# EAGLE design ESB32CARRIER (EAGLE 9.6.0)
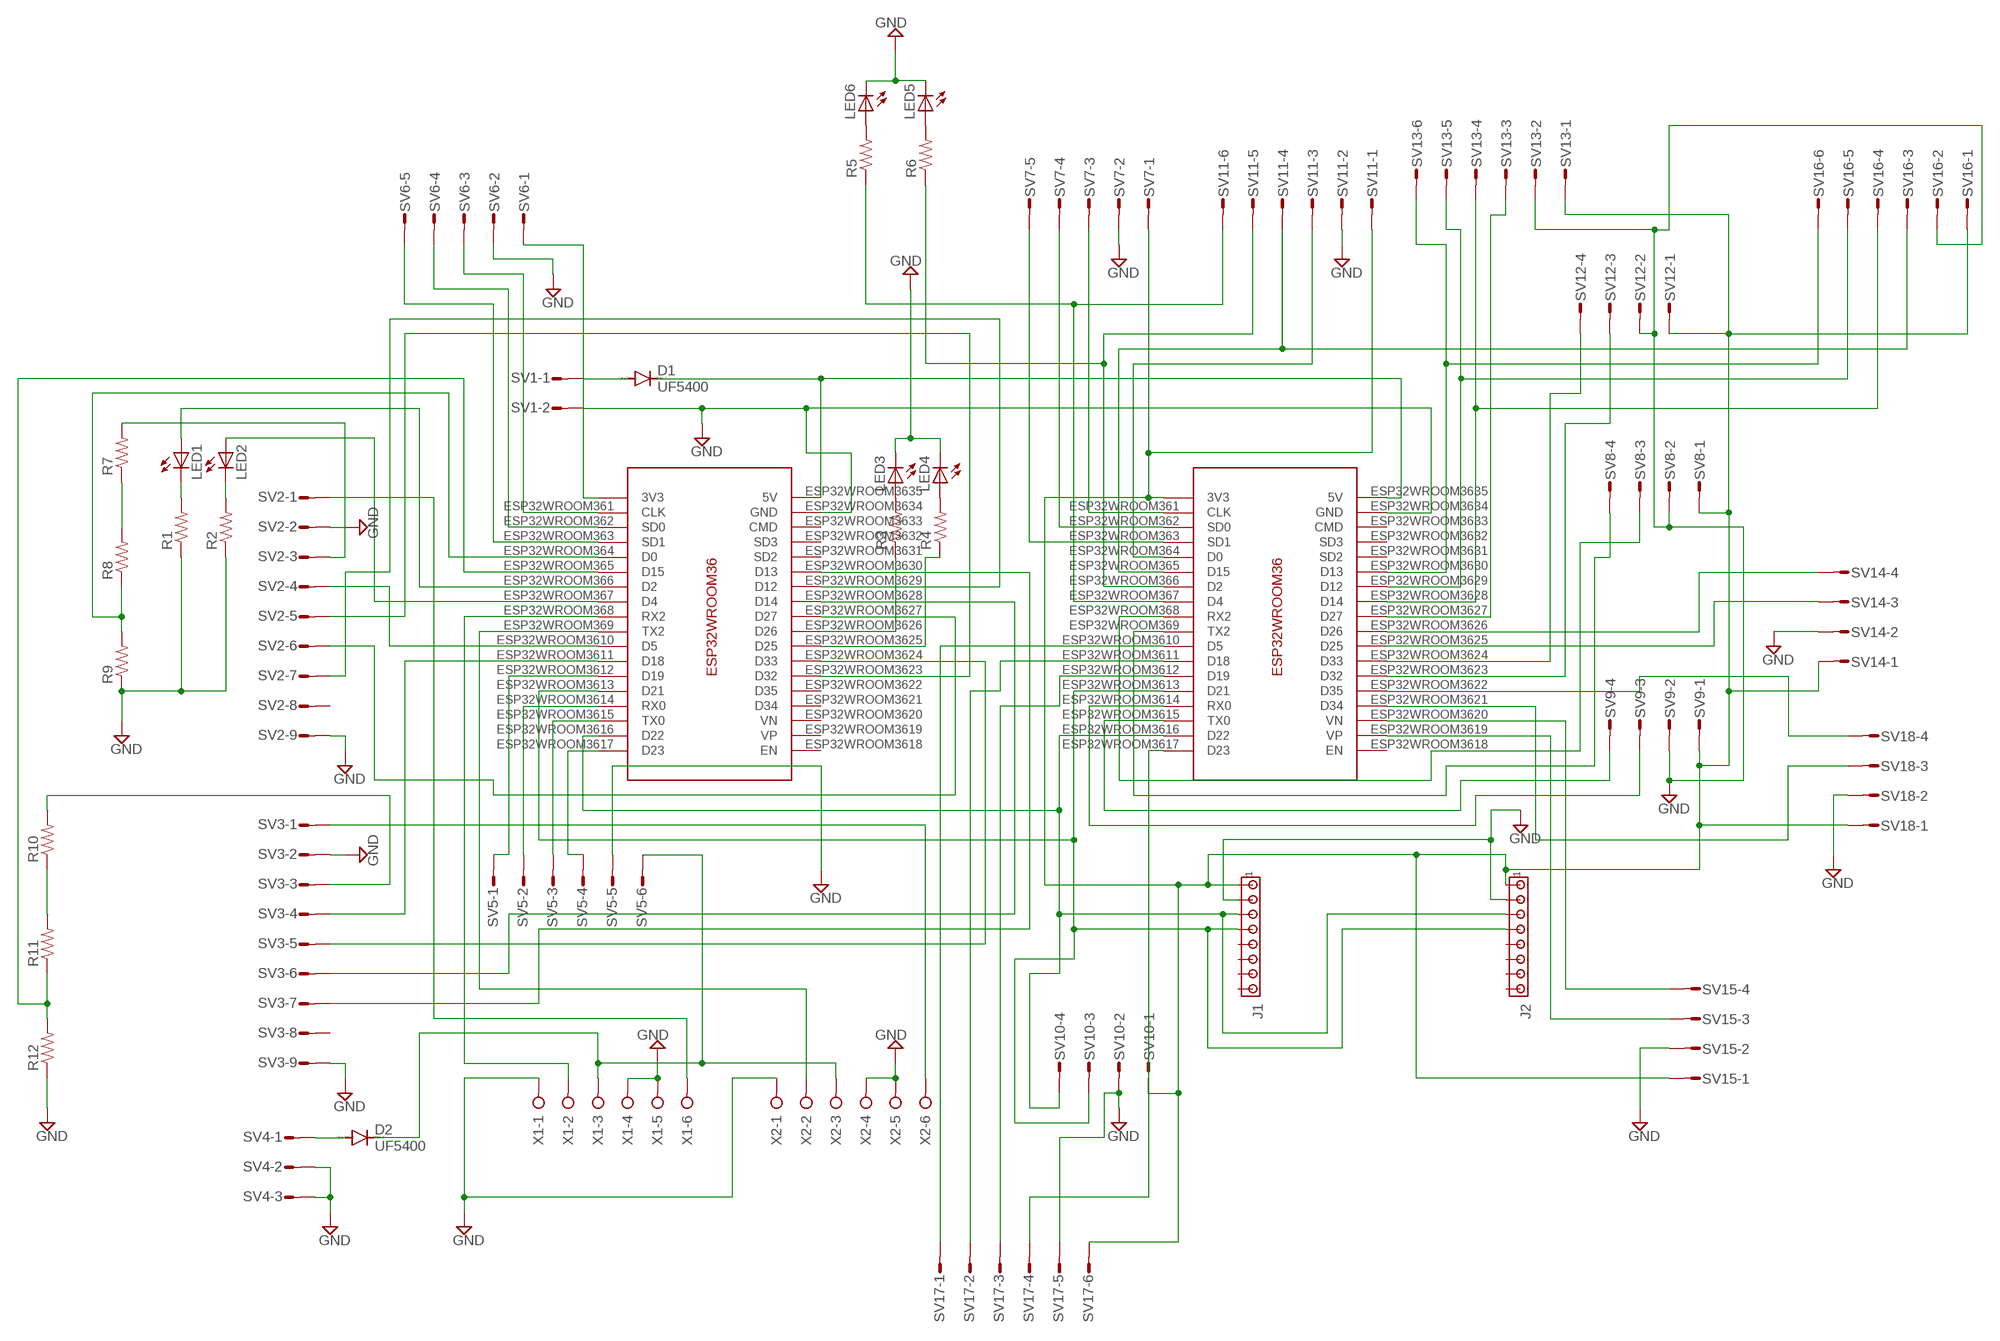
[diagram p0: schematic, sheet 1]

## Parts
D1  UF5400  [DO201-15]
D2  UF5400  [DO201-15]
J1  MTA08-100  [10X08MTA]
J2  MTA08-100  [10X08MTA]
LED1  LED3MM  [LED3MM]
LED2  LED3MM  [LED3MM]
LED3  LED3MM  [LED3MM]
LED4  LED3MM  [LED3MM]
LED5  LED3MM  [LED3MM]
LED6  LED3MM  [LED3MM]
R1  R-US_0207/10  [0207/10]
R2  R-US_0207/10  [0207/10]
R3  R-US_0207/10  [0207/10]
R4  R-US_0207/10  [0207/10]
R5  R-US_0207/10  [0207/10]
R6  R-US_0207/10  [0207/10]
R7  R-US_0207/10  [0207/10]
R8  R-US_0207/10  [0207/10]
R9  R-US_0207/10  [0207/10]
R10  R-US_0207/10  [0207/10]
R11  R-US_0207/10  [0207/10]
R12  R-US_0207/10  [0207/10]
SV1  L02P  [L02P]
SV2  L09P  [L09P]
SV3  L09P  [L09P]
SV4  L03P  [L03P]
SV5  L06P  [L06P]
SV6  L05P  [L05P]
SV7  L05P  [L05P]
SV8  L04P  [L04P]
SV9  L04P  [L04P]
SV10  L04P  [L04P]
SV11  L06P  [L06P]
SV12  L04P  [L04P]
SV13  L06P  [L06P]
SV14  L04P  [L04P]
SV15  L04P  [L04P]
SV16  L06P  [L06P]
SV17  L06P  [L06P]
SV18  L04P  [L04P]
U$1  ESP32WROOM36  [ESP32WROOM36PINDIP]
U$2  ESP32WROOM36  [ESP32WROOM36PINDIP]
X1  W237-06P  [W237-6P]
X2  W237-06P  [W237-6P]

## Nets
GND: J1.2 J2.2 LED3.K(C) LED4.K(C) LED5.K(C) LED6.K(C) R1.1 R2.1 R9.1 R12.1 SV1.2 SV2.2 SV2.9 SV3.2 SV3.9 SV4.2 SV4.3 SV5.5 SV6.2 SV7.2 SV8.2 SV9.2 SV10.2 SV11.2 SV12.2 SV13.2 SV14.2 SV15.2 SV16.2 SV17.5 SV18.2 U$1.ESP32WROOM3634(GND) U$2.ESP32WROOM3634(GND) X1.1 X1.4 X1.5 X2.1 X2.4 X2.5
N$1: D1.C U$1.ESP32WROOM3635(5V) U$2.ESP32WROOM3635(5V)
N$2: SV2.1 X1.6
N$3: D2.A SV4.1
N$4: SV3.1 X2.6
N$5: R7.1 R8.2
N$6: SV2.6 U$1.ESP32WROOM3627(D27)
N$7: D1.A SV1.1
N$8: SV5.1 U$1.ESP32WROOM3612(D19)
N$9: SV2.4 U$1.ESP32WROOM3610(D5)
N$10: U$1.ESP32WROOM368(RX2) X1.2
N$11: U$1.ESP32WROOM369(TX2) X2.2
N$12: R7.2 SV2.3
N$13: R11.1 R12.2 U$1.ESP32WROOM365(D15)
N$14: R10.1 R11.2
N$15: R10.2 SV3.3
N$16: R8.1 R9.2 U$1.ESP32WROOM364(D0)
N$17: SV3.4 U$1.ESP32WROOM3611(D18)
N$18: SV2.5 U$1.ESP32WROOM3623(D32)
N$19: SV3.5 U$1.ESP32WROOM3624(D33)
N$20: SV3.6 U$1.ESP32WROOM3628(D14)
N$21: SV2.7 U$1.ESP32WROOM3629(D12)
N$22: SV3.7 U$1.ESP32WROOM3630(D13)
N$23: J1.1 J2.1 SV7.1 SV8.1 SV9.1 SV10.1 SV11.1 SV12.1 SV13.1 SV14.1 SV15.1 SV16.1 SV17.6 SV18.1 U$2.ESP32WROOM360(3V3)
N$24: SV6.1 U$1.ESP32WROOM360(3V3)
N$25: SV7.5 U$2.ESP32WROOM363(SD1)
N$26: J1.3 J2.3 SV10.4 U$1.ESP32WROOM3616(D22) U$2.ESP32WROOM3616(D22)
N$27: J1.4 J2.4 SV10.3 U$1.ESP32WROOM3613(D21) U$2.ESP32WROOM3613(D21)
N$28: SV17.1 U$2.ESP32WROOM3610(D5)
N$29: SV6.5 U$1.ESP32WROOM363(SD1)
N$30: SV6.4 U$1.ESP32WROOM362(SD0)
N$31: SV6.3 U$1.ESP32WROOM361(CLK)
N$32: SV7.4 U$2.ESP32WROOM362(SD0)
N$33: SV7.3 U$2.ESP32WROOM361(CLK)
N$34: SV9.3 U$2.ESP32WROOM3614(RX0)
N$35: SV9.4 U$2.ESP32WROOM3615(TX0)
N$36: SV13.6 SV16.6 U$2.ESP32WROOM3630(D13)
N$37: SV13.5 SV16.5 U$2.ESP32WROOM3629(D12)
N$38: SV8.4 U$2.ESP32WROOM369(TX2)
N$39: SV8.3 U$2.ESP32WROOM368(RX2)
N$40: SV11.3 U$2.ESP32WROOM364(D0)
N$41: SV11.4 SV16.3 U$2.ESP32WROOM365(D15)
N$42: R6.1 SV11.5 U$2.ESP32WROOM366(D2)
N$43: R5.1 SV11.6 U$2.ESP32WROOM367(D4)
N$44: SV12.3 U$2.ESP32WROOM3623(D32)
N$45: SV12.4 U$2.ESP32WROOM3624(D33)
N$46: SV13.4 SV16.4 U$2.ESP32WROOM3628(D14)
N$47: SV13.3 U$2.ESP32WROOM3627(D27)
N$48: SV17.2 U$2.ESP32WROOM3611(D18)
N$49: SV14.4 U$2.ESP32WROOM3626(D26)
N$50: SV14.3 U$2.ESP32WROOM3625(D25)
N$51: SV15.4 U$2.ESP32WROOM3620(VN)
N$52: SV15.3 U$2.ESP32WROOM3619(VP)
N$53: SV17.3 U$2.ESP32WROOM3612(D19)
N$54: SV17.4 U$2.ESP32WROOM3617(D23)
N$55: SV5.4 U$1.ESP32WROOM3617(D23)
N$56: SV5.2 U$1.ESP32WROOM3614(RX0)
N$57: D2.C SV5.6 X1.3 X2.3
N$58: LED3.A R3.2
N$59: SV5.3 U$1.ESP32WROOM3615(TX0)
N$60: LED1.K(C) R1.2
N$61: LED2.K(C) R2.2
N$62: LED1.A U$1.ESP32WROOM366(D2)
N$63: LED2.A U$1.ESP32WROOM367(D4)
N$64: LED4.A R4.2
N$65: R3.1 U$1.ESP32WROOM3626(D26)
N$66: R4.1 U$1.ESP32WROOM3625(D25)
N$67: LED6.A R5.2
N$68: SV18.4 U$2.ESP32WROOM3622(D35)
N$69: SV18.3 U$2.ESP32WROOM3621(D34)
N$70: LED5.A R6.2
Unconnected: J1.5 J1.6 J1.7 J1.8 J2.5 J2.6 J2.7 J2.8 SV2.8 SV3.8 U$1.ESP32WROOM3618(EN) U$1.ESP32WROOM3619(VP) U$1.ESP32WROOM3620(VN) U$1.ESP32WROOM3621(D34) U$1.ESP32WROOM3622(D35) U$1.ESP32WROOM3631(SD2) U$1.ESP32WROOM3632(SD3) U$1.ESP32WROOM3633(CMD) U$2.ESP32WROOM3618(EN) U$2.ESP32WROOM3631(SD2) U$2.ESP32WROOM3632(SD3) U$2.ESP32WROOM3633(CMD)

## Library data of the parts
D1 D2 = diode:UF5400: DIODE ultra fast rectifier, 3 A
J1 J2 = con-amp:MTA08-100: AMP connector
LED1-LED6 = adafruit:LED: LED OSRAM: - CHIPLED LG R971, LG N971, LY N971, LG Q971, LY Q971, LO R971, LY R971 LH N974, LH R974 LS Q976, LO Q976, LY Q976 LO Q996 - Hyper CHIPLED LW Q18S LB Q993, LB Q99A, LB R99A - SideLED LS A670, LO A670, LY A670, LG A670, LP A670 LB A673, LV A673, LT A673, LW A673 LH A674 LY A675 LS A676, LA A676, LO A676, LY A676, LW A676 LS A679, LY A679, LG A679 - Hyper Micro SIDELED® LS Y876, LA Y876, LO Y876, LY Y876 LT Y87S - SmartLED LW L88C, LW L88S LB L89C, LB L89S, LG L890 LS L89K, LO L89K, LY L89K LS L896, LA L896, LO L896, LY L896 - TOPLED LS T670, LO T670, LY T670, LG T670, LP T670 LSG T670, LSP T670, LSY T670, LOP T670, LYG T670 LG T671, LOG T671, LSG T671 LB T673, LV T673, LT T673, LW T673 LH T674 LS T676, LA T676, LO T676, LY T676, LB T676, LH T676, LSB T676, LW T676 LB T67C, LV T67C, LT T67C, LS T67K, LO T67K, LY T67K, LW E67C LS E67B, LA E67B, LO E67B, LY E67B, LB E67C, LV E67C, LT E67C LW T67C LS T679, LY T679, LG T679 LS T770, LO T770, LY T770, LG T770, LP T770 LB T773, LV T773, LT T773, LW T773 LH T774 LS E675, LA E675, LY E675, LS T675 LS T776, LA T776, LO T776, LY T776, LB T776 LHGB T686 LT T68C, LB T68C - Hyper Mini TOPLED® LB M676 - Mini TOPLED Santana® LG M470 LS M47K, LO M47K, LY M47K Source: http://www.osram.convergy.de/
R1-R12 = adafruit:R-US_: RESISTOR, American symbol
SV1 = con-amp-mt:L02P: AMP MT CONNECTOR; OC_FARNELL: unknown; OC_NEWARK: unknown
SV2 SV3 = con-amp-mt:L09P: AMP MT CONNECTOR; OC_FARNELL: unknown; OC_NEWARK: unknown
SV4 = con-amp-mt:L03P: AMP MT CONNECTOR; OC_FARNELL: unknown; OC_NEWARK: unknown
SV5 SV11 SV13 SV16 SV17 = con-amp-mt:L06P: AMP MT CONNECTOR; OC_FARNELL: unknown; OC_NEWARK: unknown
SV6 SV7 = con-amp-mt:L05P: AMP MT CONNECTOR; OC_FARNELL: unknown; OC_NEWARK: unknown
SV8-SV10 SV12 SV14 SV15 SV18 = con-amp-mt:L04P: AMP MT CONNECTOR; OC_FARNELL: unknown; OC_NEWARK: unknown
U$1 U$2 = ESP32WROOM36:ESP32WROOM36
X1 X2 = con-wago-508:W237-06P: WAGO SREW CLAMP; OC_FARNELL: unknown; OC_NEWARK: unknown

## Board
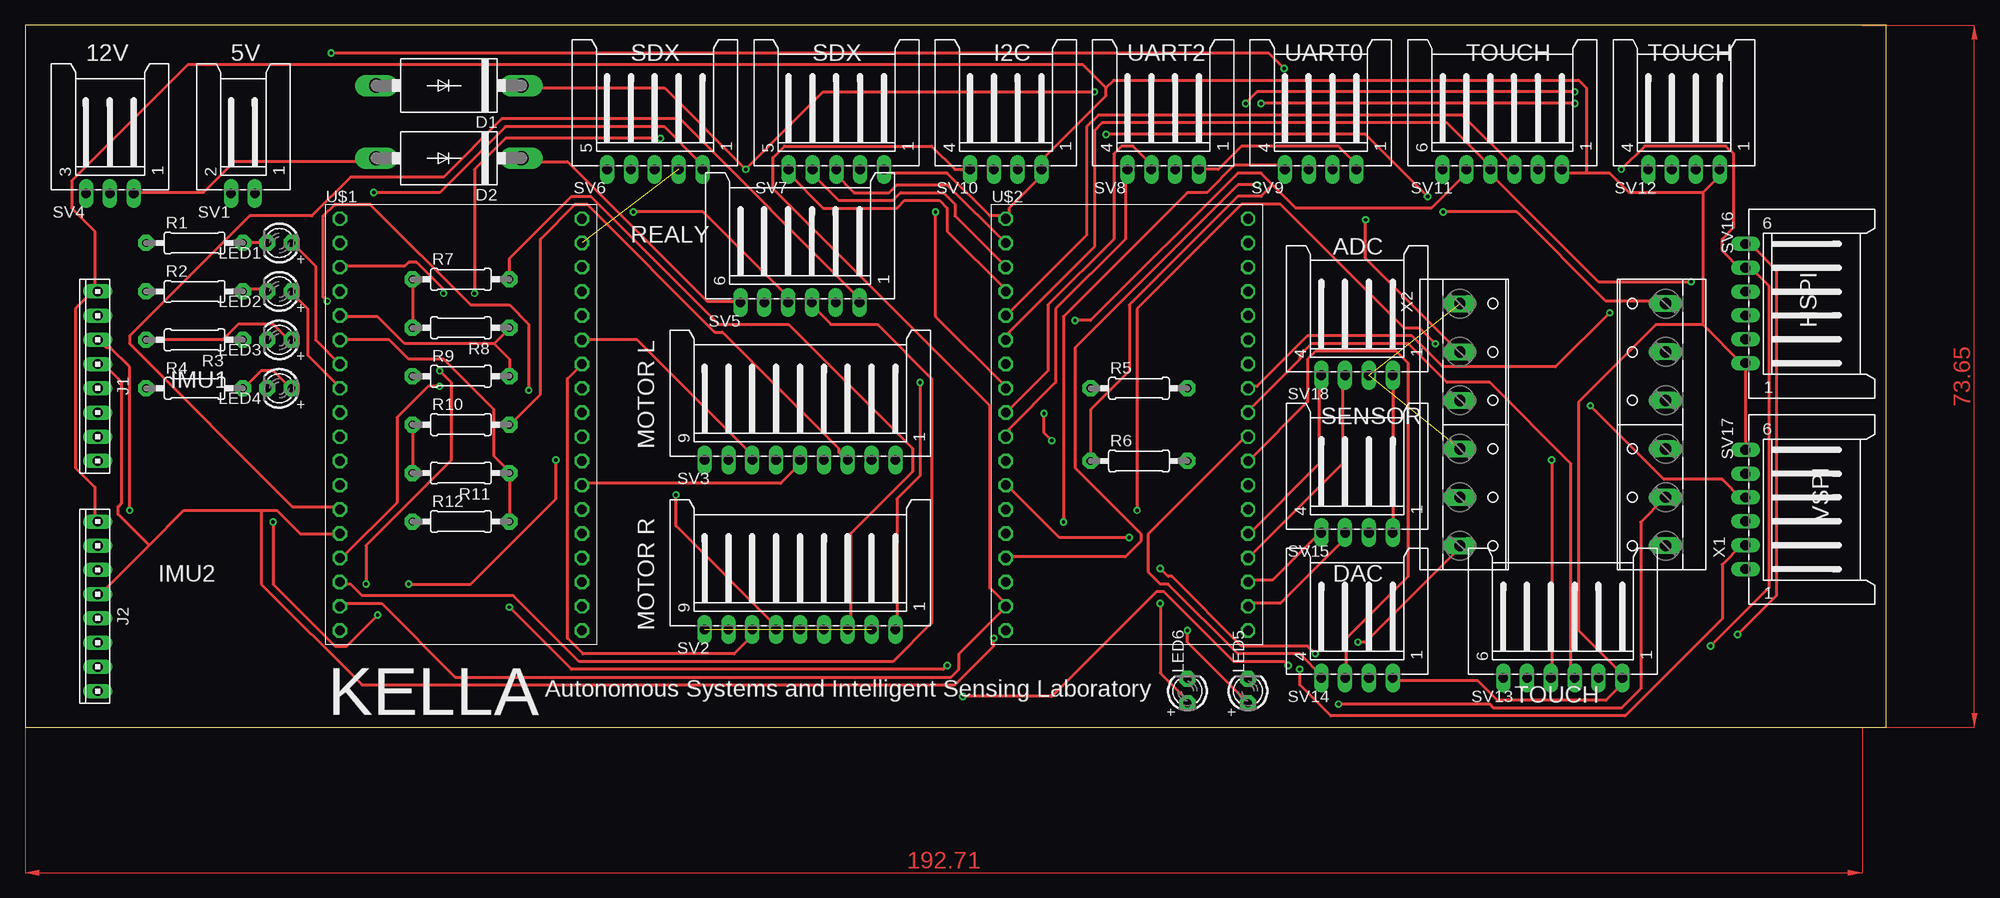
[diagram p1: board, top side]
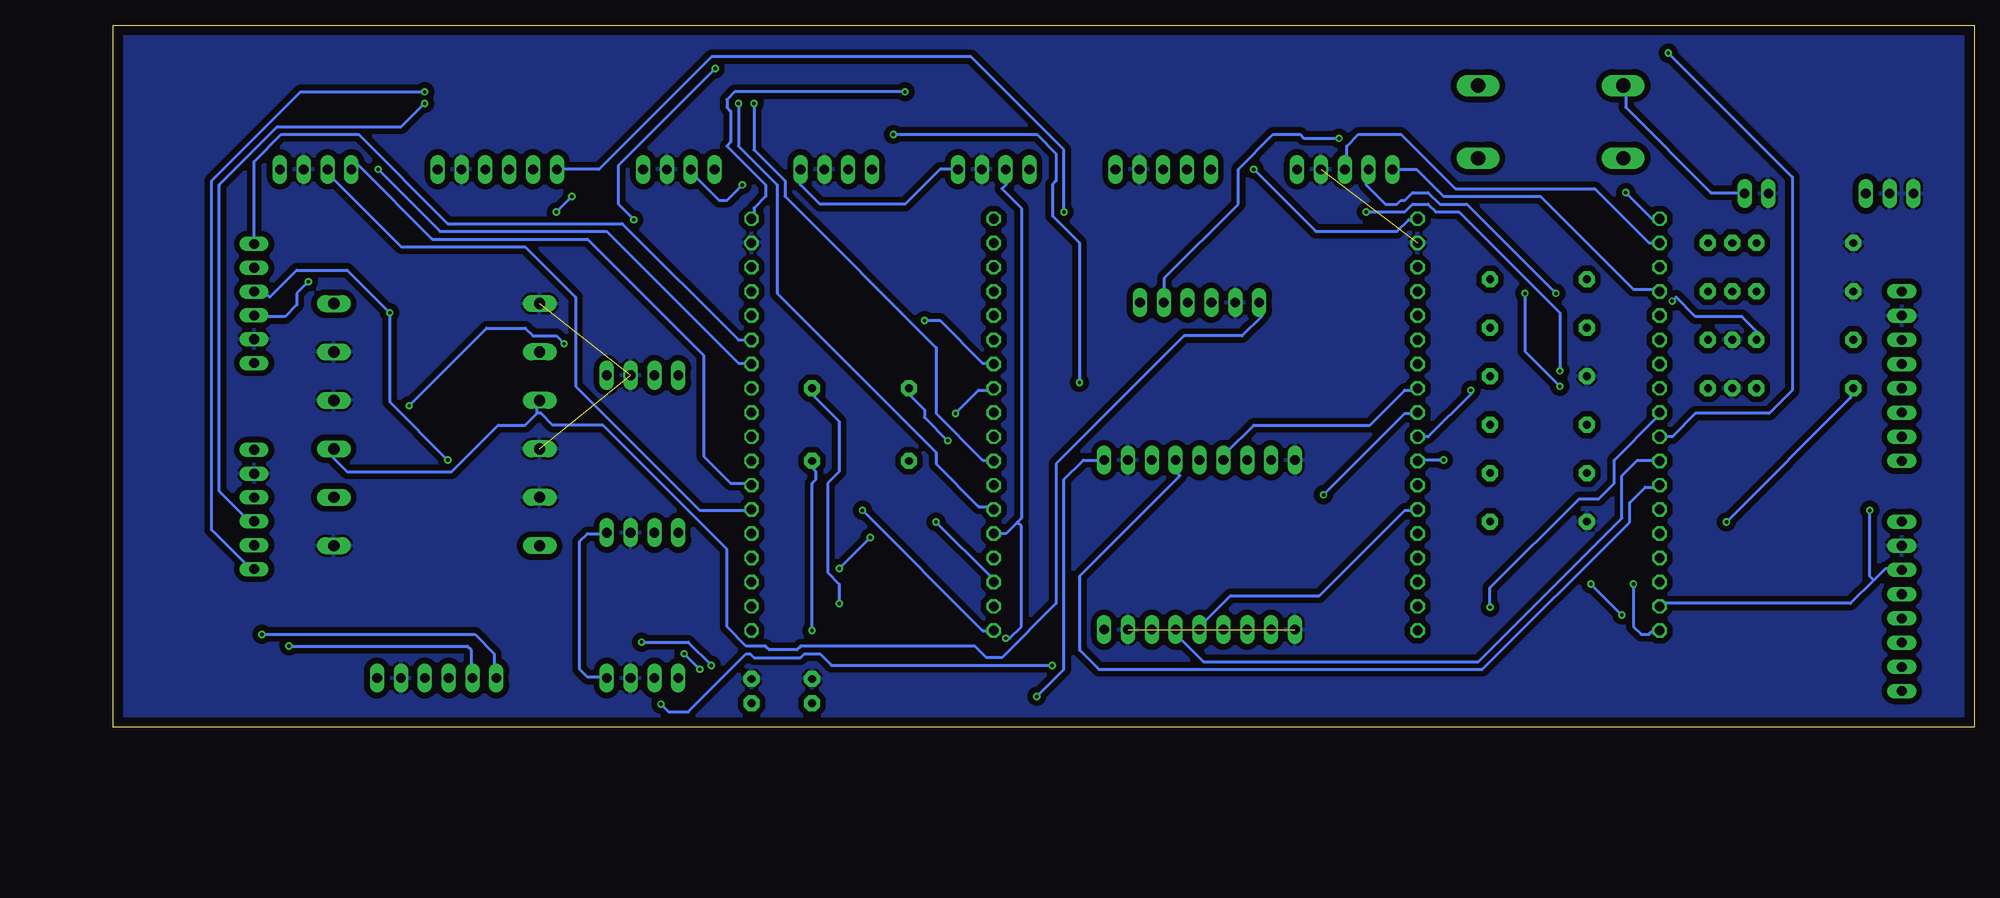
[diagram p2: board, bottom side, seen from below]

Size 195.25 x 73.65 mm. Coordinates in mm from the lower left corner, seen from the top.
Outline: 0,0 195.25,0 195.25,73.65 0,73.65 0,0
Copper layers (1*16): Top 0.035mm / dielectric 1.5mm / Bottom 0.035mm
Design rules "default *": minimum track width 12mil, minimum drill 0.35mm, track to track 20mil, track to pad 20mil, pad to pad 12mil, via to via 12mil, smd to smd 6mil, copper to edge 40mil, drill to drill 12mil, minimum pad ring 10mil, minimum via ring 8mil, stop-mask expansion 4mil, vias tented up to drill 0mil, thermal gap 10mil

### Footprints (pad centres in the part's own frame; a part is rotated, then mirrored left to right if it is on the bottom)
DO201-15 = drill 1.499 long: A 7.62,0; C -7.62,0
10X08MTA = drill 1.016 long: 1 8.89,0; 2 6.35,0; 3 3.81,0; 4 1.27,0; 5 -1.27,0; 6 -3.81,0; 7 -6.35,0; 8 -8.89,0
LED3MM = drill 0.813 pad 1.676 octagon: A -1.27,0; K 1.27,0
0207/10 = drill 0.813 pad 1.676 octagon: 1 -5.08,0; 2 5.08,0
L02P = drill 1.016 long: 1 1.25,-6.25; 2 -1.25,-6.25
L09P = drill 1.016 long: 1 10,-6.25; 2 7.5,-6.25; 3 5,-6.25; 4 2.5,-6.25; 5 0,-6.25; 6 -2.5,-6.25; 7 -5,-6.25; 8 -7.5,-6.25; 9 -10,-6.25
L03P = drill 1.016 long: 1 2.5,-6.25; 2 0,-6.25; 3 -2.5,-6.25
L06P = drill 1.016 long: 1 6.25,-6.25; 2 3.75,-6.25; 3 1.25,-6.25; 4 -1.25,-6.25; 5 -3.75,-6.25; 6 -6.25,-6.25
L05P = drill 1.016 long: 1 5,-6.25; 2 2.5,-6.25; 3 0,-6.25; 4 -2.5,-6.25; 5 -5,-6.25
L04P = drill 1.016 long: 1 3.75,-6.25; 2 1.25,-6.25; 3 -1.25,-6.25; 4 -3.75,-6.25
ESP32WROOM36PINDIP = drill 1 octagon: ESP32WROOM360 -21.59,15.24; ESP32WROOM361 -21.59,12.7; ESP32WROOM362 -21.59,10.16; ESP32WROOM363 -21.59,7.62; ESP32WROOM364 -21.59,5.08; ESP32WROOM365 -21.59,2.54; ESP32WROOM366 -21.59,0; ESP32WROOM367 -21.59,-2.54; ESP32WROOM368 -21.59,-5.08; ESP32WROOM369 -21.59,-7.62; ESP32WROOM3610 -21.59,-10.16; ESP32WROOM3611 -21.59,-12.7; ESP32WROOM3612 -21.59,-15.24; ESP32WROOM3613 -21.59,-17.78; ESP32WROOM3614 -21.59,-20.32; ESP32WROOM3615 -21.59,-22.86; ESP32WROOM3616 -21.59,-25.4; ESP32WROOM3617 -21.59,-27.94; ESP32WROOM3618 3.81,-27.94; ESP32WROOM3619 3.81,-25.4; ESP32WROOM3620 3.81,-22.86; ESP32WROOM3621 3.81,-20.32; ESP32WROOM3622 3.81,-17.78; ESP32WROOM3623 3.81,-15.24; ESP32WROOM3624 3.81,-12.7; ESP32WROOM3625 3.81,-10.16; ESP32WROOM3626 3.81,-7.62; ESP32WROOM3627 3.81,-5.08; ESP32WROOM3628 3.81,-2.54; ESP32WROOM3629 3.81,0; ESP32WROOM3630 3.81,2.54; ESP32WROOM3631 3.81,5.08; ESP32WROOM3632 3.81,7.62; ESP32WROOM3633 3.81,10.16; ESP32WROOM3634 3.81,12.7; ESP32WROOM3635 3.81,15.24
W237-6P = drill 1.194 long: 1 -12.7,-0.635; 2 -7.62,-0.635; 3 -2.54,-0.635; 4 2.54,-0.635; 5 7.62,-0.635; 6 12.7,-0.635

### Placement (x,y rotation side)
D1  44.45,67.31 180 top
D2  44.45,59.69 180 top
J1  7.62,36.83 90 top
J2  7.62,12.7 90 top
LED1  26.67,50.8 180 top
LED2  26.67,45.72 180 top
LED3  26.67,40.64 180 top
LED4  26.67,35.56 180 top
LED5  128.27,3.81 90 top
LED6  121.92,3.81 90 top
R1  17.78,50.8 0 top
R2  17.78,45.72 0 top
R3  17.78,40.64 180 top
R4  17.78,35.56 0 top
R5  116.84,35.56 0 top
R6  116.84,27.94 0 top
R7  45.72,46.99 0 top
R8  45.72,41.91 180 top
R9  45.72,36.83 0 top
R10  45.72,31.75 0 top
R11  45.72,26.67 180 top
R12  45.72,21.59 0 top
SV1  22.86,62.23 0 top
SV2  81.28,16.51 0 top
SV3  81.28,34.29 0 top
SV4  8.89,62.23 0 top
SV5  81.28,50.8 0 top
SV6  66.04,64.77 0 top
SV7  85.09,64.77 0 top
SV8  119.38,64.77 0 top
SV9  135.89,64.77 0 top
SV10  102.87,64.77 0 top
SV11  154.94,64.77 0 top
SV12  173.99,64.77 0 top
SV13  161.29,11.43 0 top
SV14  139.7,11.43 0 top
SV15  139.7,26.67 0 top
SV16  186.69,44.45 270 top
SV17  186.69,22.86 270 top
SV18  139.7,43.18 0 top
U$1  54.61,38.1 0 top
U$2  124.46,38.1 0 top
X1  171.45,31.75 90 top
X2  151.13,31.75 270 top

### Tracks (layer width: path | path; a pad name or v marks a point on that pad's centre or on a via)
GND  (4 unrouted)
  pour Bottom (isolate 0.61): 0,73.66 195.58,73.66 195.58,0 0,0
N$1  (via drill 0.35)
  Top 0.305: D1.C 52.43,67.06 67.06,67.06 v75.59,58.52 83.72,66.65 v112.17,66.65
  Bottom 0.305: v75.59,58.52 69.09,52.02 60.55,52.02 59.33,53.24 58.52,53.24 U$1.ESP32WROOM3635 | v112.17,66.65 130.05,66.65 130.86,65.84 130.86,65.02 130.45,64.62 130.45,61.37 130.86,60.96 126.8,56.9 126.8,55.68 128.02,54.46 128.02,53.65 U$2.ESP32WROOM3635
N$2  (via drill 0.35)
  Top 0.305: v93.88,36.17 93.88,26.42 91.44,23.98 91.44,10.57 SV2.1 | v113.39,62.18 140.61,62.18 v147.12,55.68 | v148.74,54.05 156.46,54.05 165.81,44.7 171.91,44.7 X1.6
  Bottom 0.305: v93.88,36.17 93.88,50.8 96.72,53.65 96.72,56.9 96.32,57.3 96.32,60.15 98.35,62.18 v113.39,62.18 | v148.74,54.05 v147.12,55.68
N$3
  Top 0.305: SV4.1 11.79,56.08 18.69,56.08 21.95,59.33 36.58,59.33 D2.A
N$4  (via drill 0.35)
  Top 0.305: v98.35,3.25 107.7,3.25 118.67,14.22 119.48,14.22 126.8,6.91 132.08,6.91 v132.49,6.5 | v139.8,8.94 140.61,8.94 150.37,18.69 X2.6
  Bottom 0.305: v98.35,3.25 95.5,6.1 95.5,26.01 93.47,28.04 91.44,28.04 SV3.1 | v132.49,6.5 134.93,8.94 v139.8,8.94
N$5
  Top 0.305: R7.1 R8.2
N$6  (via drill 0.35)
  Top 0.305: v68.28,24.38 68.28,21.13 78.84,10.57 SV2.6
  Bottom 0.305: v68.28,24.38 59.74,32.92 58.52,32.92 U$1.ESP32WROOM3627
N$7
  Bottom 0.305: SV1.1 24.38,56.08 27.64,56.08 36.58,65.02 36.58,67.06 D1.A
N$8
  Top 0.305: U$1.ESP32WROOM3612 32.92,23.16 28.04,23.16 10.97,40.23 10.97,41.05 23.57,53.65 30.07,53.65 34.14,57.71 43.89,57.71 49.99,63.8 68.68,63.8 87.78,44.7 SV5.1
N$9
  Bottom 0.305: U$1.ESP32WROOM3610 33.33,28.04 35.36,28.04 36.98,26.42 36.98,21.95 52.02,6.91 80.87,6.91 84.12,10.16 SV2.4
N$10  (via drill 0.35)
  Top 0.305: v50.8,12.6 57.3,6.1 96.32,6.1 v96.72,6.5 | v137.77,2.44 153.62,2.44 154.03,2.03 167.44,2.03 169.47,4.06 169.47,21.54 171.91,23.98 X1.2
  Bottom 0.305: v50.8,12.6 50.8,14.63 41.45,23.98 39.42,23.98 37.8,25.6 37.8,28.04 33.33,32.51 33.33,32.92 U$1.ESP32WROOM368 | v96.72,6.5 119.89,6.5 121.11,7.72 122.73,7.72 123.14,7.32 128.02,7.32 128.42,7.72 128.83,7.72 134.93,1.63 136.96,1.63 v137.77,2.44
N$11  (via drill 0.35)
  Top 0.305: v32.11,70.71 130.45,70.71 v132.08,69.09 | v140.61,53.24 140.61,49.17 150.37,39.42 X2.2
  Bottom 0.305: U$1.ESP32WROOM369 31.7,30.48 29.26,32.92 21.54,32.92 19.1,35.36 19.1,57.71 v32.11,70.71 | v132.08,69.09 142.24,58.93 142.24,54.86 v140.61,53.24
N$12
  Top 0.305: R7.2 50.8,49.17 57.3,55.68 59.33,55.68 72.75,42.27 80.06,42.27 93.07,29.26 93.07,26.82 86.56,20.32 86.56,10.57 SV2.3
N$13
  Top 0.305: U$1.ESP32WROOM365 38.2,40.64 40.23,38.61 43.89,38.61 49.17,33.33 49.17,28.45 50.8,26.82 R11.1 R12.2
N$14
  Top 0.305: R10.1 R11.2
N$15
  Top 0.305: SV3.3 86.16,28.04 85.34,28.85 85.34,29.26 73.15,41.45 72.34,41.45 58.93,54.86 57.71,54.86 54.05,51.21 54.05,34.95 50.8,31.7 R10.2
N$16
  Top 0.305: 49.17,40.23 39.83,40.23 36.98,43.08 33.33,43.08 U$1.ESP32WROOM364 | 49.17,40.23 50.8,41.86 R8.1 | R9.2 50.8,38.61 49.17,40.23
N$17
  Bottom 0.305: U$1.ESP32WROOM3611 33.33,25.2 34.54,25.2 36.17,23.57 36.17,21.54 51.61,6.1 91.85,6.1 93.88,8.13 93.88,15.85 83.31,26.42 83.72,26.82 83.72,27.64 SV3.4
N$18
  Bottom 0.305: U$1.ESP32WROOM3623 58.52,22.76 59.74,22.76 68.68,13.82 78.03,13.82 81.28,10.57 SV2.5
N$19
  Top 0.305: U$1.ESP32WROOM3624 58.52,25.6 79.25,25.6 81.28,27.64 SV3.5
N$20
  Bottom 0.305: U$1.ESP32WROOM3628 58.52,35.36 59.74,35.36 63.4,31.7 75.59,31.7 78.44,28.85 78.44,28.04 SV3.6
N$21
  Top 0.305: U$1.ESP32WROOM3629 56.9,36.58 56.9,9.35 58.52,7.72 74.37,7.72 76,9.35 76,10.16 SV2.7
N$22
  Top 0.305: U$1.ESP32WROOM3630 64.21,40.64 76,28.85 76,28.04 SV3.7
N$23
  Top 0.305: SV17.6 180.44,29.26 180.44,37.8 SV16.1 180.03,38.2 175.97,42.27 | 163.78,58.12 166.22,58.12 168.25,56.08 175.97,56.08 | 163.78,58.12 161.34,58.12 SV11.1 | 175.97,56.08 178,58.12 SV12.1 | 175.97,56.08 175.97,42.27 | SV15.1 143.46,20.73 143.46,36.58 SV18.1 | SV14.1 143.46,4.88 152.4,4.88 154.43,2.85 165.81,2.85 167.84,4.88 SV13.1 167.84,5.28 162.97,10.16 162.97,34.14 171.09,42.27 175.97,42.27 | 7.32,45.92 5.28,43.89 5.28,27.23 7.32,25.2 7.32,21.95 J2.1 | SV8.1 125.17,58.52 127.61,60.96 137.77,60.96 139.4,59.33 139.4,58.52 SV9.1 | SV7.1 90.22,58.12 96.72,58.12 101.19,53.65 102.82,53.65 U$2.ESP32WROOM360 103.23,53.65 103.23,54.46 106.88,58.12 SV10.1 106.88,58.52 106.88,59.74 113.39,66.24 113.39,67.06 | 7.32,45.92 7.32,52.02 4.88,54.46 4.88,57.3 17.07,69.49 110.95,69.49 113.39,67.06 | 7.32,45.92 J1.1 | 163.78,58.12 163.78,67.06 162.97,67.87 114.2,67.87 113.39,67.06
  Bottom 0.305: SV15.1 143.46,20.32 145.49,20.32 146.3,19.51 146.3,6.1 145.49,5.28 143.46,5.28 SV14.1 | SV8.1 123.14,58.12 123.14,56.9 121.11,54.86 112.17,54.86 108.51,58.52 106.88,58.52 SV10.1
N$24  (via drill 0.35)
  Top 0.305: v36.58,56.08 43.48,56.08 50.39,62.99 67.06,62.99 70.71,59.33 70.71,58.52 SV6.1
  Bottom 0.305: v36.58,56.08 33.73,53.24 33.33,53.24 U$1.ESP32WROOM360
N$25
  Top 0.305: U$2.ESP32WROOM363 102.82,45.92 96.72,52.02 96.72,54.46 95.91,55.27 92.25,55.27 91.44,54.46 83.72,54.46 80.06,58.12 SV7.5
N$26  (via drill 0.35)
  Top 0.305: U$1.ESP32WROOM3616 33.33,13.01 37.39,13.01 45.11,5.28 97.13,5.28 97.94,6.1 97.94,7.72 102.82,12.6 U$2.ESP32WROOM3616 102.82,13.01 101.19,14.63 101.19,33.73 78.44,56.49 78.44,59.74 79.65,60.96 95.1,60.96 97.54,58.52 98.75,58.52 SV10.4 | v10.97,22.76 10.97,37.8 8.94,39.83 8.53,39.83 7.72,40.64 J1.3
  Bottom 0.305: 10.57,15.44 9.35,16.66 7.72,16.66 J2.3 | 10.57,15.44 13.01,13.01 32.92,13.01 U$1.ESP32WROOM3616 | v10.97,22.76 10.97,15.85 10.57,15.44
N$27  (via drill 0.35)
  Top 0.305: U$1.ESP32WROOM3613 28.85,20.32 26.42,22.76 24.79,22.76 | 24.79,22.76 16.66,22.76 13.01,19.1 | 13.01,19.1 7.72,13.82 J2.4 | 13.01,19.1 9.75,22.35 9.75,23.16 10.16,23.57 10.16,36.17 8.53,37.8 7.72,37.8 J1.4 | v101.6,9.35 101.6,8.53 97.54,4.47 35.36,4.47 24.79,15.04 24.79,22.76
  Bottom 0.305: U$2.ESP32WROOM3613 101.6,20.32 100.38,21.54 | 100.38,21.54 99.97,21.95 99.97,54.46 102.01,56.49 101.6,56.9 101.6,58.12 SV10.3 | 100.38,21.54 99.97,21.13 99.97,10.57 101.19,9.35 v101.6,9.35
N$28  (via drill 0.35)
  Top 0.305: v128.02,65.43 129.24,66.65 v162.56,66.65
  Bottom 0.305: v128.02,65.43 128.02,60.55 124.77,57.3 124.77,55.68 108.92,39.83 108.92,32.92 104.04,28.04 103.23,28.04 U$2.ESP32WROOM3610 | v162.56,66.65 175.56,66.65 184.91,57.3 184.91,20.73 180.44,16.26 SV17.1
N$29
  Bottom 0.305: U$1.ESP32WROOM363 33.33,45.92 35.76,45.92 45.52,55.68 55.68,55.68 58.52,58.52 60.96,58.52 SV6.5
N$30  (via drill 0.35)
  Top 0.305: v43.89,45.52 43.89,45.92 41.05,48.77 40.23,48.77 39.83,48.36 33.33,48.36 U$1.ESP32WROOM362
  Bottom 0.305: v43.89,45.52 53.24,54.86 56.08,54.86 57.3,56.08 58.93,56.08 59.74,55.27 60.15,55.27 60.55,54.86 61.77,54.86 63.8,56.9 63.8,58.12 SV6.4
N$31
  Bottom 0.305: U$1.ESP32WROOM361 34.14,50.8 39.83,56.49 54.46,56.49 60.15,62.18 64.62,62.18 65.84,60.96 65.84,58.52 SV6.3
N$32
  Top 0.305: U$2.ESP32WROOM362 102.82,48.36 97.54,53.65 97.54,54.86 96.32,56.08 91.85,56.08 91.03,55.27 85.34,55.27 82.5,58.12 SV7.4
N$33
  Top 0.305: U$2.ESP32WROOM361 102.82,50.8 96.72,56.9 91.44,56.9 90.63,56.08 86.97,56.08 84.94,58.12 SV7.3
N$34  (via drill 0.35)
  Top 0.305: v129.24,56.9 127.2,56.9 110.13,39.83 110.13,27.23 117.04,20.32 117.04,19.51 115.42,17.88 103.23,17.88 U$2.ESP32WROOM3614
  Bottom 0.305: v129.24,56.9 130.86,55.27 131.67,55.27 134.52,58.12 SV9.3
N$35  (via drill 0.35)
  Top 0.305: v108.92,21.54 108.92,43.08 121.92,56.08 123.95,56.08 126.8,58.93 131.67,58.93 132.08,58.52 SV9.4
  Bottom 0.305: v108.92,21.54 103.23,15.85 103.23,15.44 U$2.ESP32WROOM3615
N$36  (via drill 0.35)
  Top 0.305: v179.63,9.75 183.69,13.82 183.69,47.95 181.25,50.39 180.44,50.39 SV16.6
  Bottom 0.305: U$2.ESP32WROOM3630 129.64,40.64 141.83,52.83 160.12,52.83 169.47,62.18 177.6,62.18 180.44,59.33 180.44,50.8 SV16.6 | v179.63,9.75 157.28,9.75 155.25,7.72 155.25,5.28 SV13.6
N$37  (via drill 0.35)
  Top 0.305: v167.44,58.52 169.88,60.96 178.41,60.96 179.22,60.15 179.22,52.43 178,51.21 178,49.99 180.03,47.95 SV16.5 180.44,47.95 181.25,47.95 182.88,46.33 182.88,14.63 v176.78,8.53
  Bottom 0.305: v167.44,58.52 160.93,52.02 143.46,52.02 129.64,38.2 128.42,38.2 U$2.ESP32WROOM3629 | v176.78,8.53 158.09,8.53 157.68,8.13 157.68,5.28 SV13.5
N$38
  Top 0.305: U$2.ESP32WROOM369 103.23,30.48 103.23,31.29 108.1,36.17 108.1,43.89 115.42,51.21 115.42,58.12 SV8.4
N$39
  Top 0.305: U$2.ESP32WROOM368 103.23,33.33 107.29,37.39 107.29,44.3 114.2,51.21 114.2,60.15 115.01,60.96 116.23,60.96 117.86,59.33 117.86,58.52 SV8.3
N$40
  Top 0.305: U$2.ESP32WROOM364 103.23,43.48 111.35,51.61 111.35,62.99 112.57,64.21 150.77,64.21 156.46,58.52 SV11.3
N$41  (via drill 0.35)
  Top 0.305: U$2.ESP32WROOM365 103.23,40.64 103.23,41.45 112.17,50.39 112.17,62.59 112.98,63.4 149.15,63.4 154.03,58.52 SV11.4 153.62,58.12 165,46.74 v174.75,46.74
  Bottom 0.305: v174.75,46.74 175.97,45.52 175.97,44.3 177.19,43.08 180.03,43.08 SV16.3
N$42  (via drill 0.35)
  Top 0.305: v110.13,42.67 111.76,42.67 127.2,58.12 129.64,58.12 130.86,56.9 | 130.86,56.9 133.3,54.46 147.52,54.46 151.18,58.12 SV11.5 | R6.1 111.76,33.33 115.82,37.39 115.82,44.3 127.2,55.68 129.64,55.68 130.86,56.9
  Bottom 0.305: v110.13,42.67 108.51,42.67 104.04,38.2 103.23,38.2 U$2.ESP32WROOM366
N$43  (via drill 0.35)
  Top 0.305: v106.88,32.92 106.88,30.89 v107.7,30.07 | v95.5,54.05 95.5,43.08 102.82,35.76 U$2.ESP32WROOM367
  Bottom 0.305: v106.88,32.92 104.44,35.36 103.23,35.36 U$2.ESP32WROOM367 | v107.7,30.07 110.13,32.51 110.13,33.33 111.76,34.95 R5.1 | v95.5,54.05 95.5,60.55 105.26,70.31 132.49,70.31 144.27,58.52 148.34,58.52 SV11.6
N$44
  Bottom 0.305: U$2.ESP32WROOM3623 128.42,22.76 133.71,22.76 146.71,35.76 146.71,45.11 151.99,50.39 165,50.39 172.72,58.12 SV12.3
N$45
  Bottom 0.305: U$2.ESP32WROOM3624 128.42,25.6 130.45,25.6 133.3,28.45 133.3,39.01 145.49,51.21 161.75,51.21 169.47,58.93 169.88,58.93 170.28,58.52 SV12.4
N$46  (via drill 0.35)
  Top 0.305: v166.22,43.48 160.53,37.8 148.74,37.8 145.49,41.05 134.52,41.05 129.24,35.76 128.42,35.76 U$2.ESP32WROOM3628 | v160.12,28.04 160.12,5.28 SV13.4
  Bottom 0.305: SV16.4 180.03,45.52 179.22,45.52 178.82,45.11 175.97,47.95 170.69,47.95 v166.22,43.48 166.22,34.14 v160.12,28.04
N$47
  Top 0.305: U$2.ESP32WROOM3627 128.42,33.33 133.71,38.61 133.71,39.01 134.93,40.23 145.09,40.23 149.15,36.17 153.62,36.17 162.15,27.64 162.15,5.28 SV13.3
N$48  (via drill 0.35)
  Top 0.305: v115.82,19.91 108.51,19.91 103.23,25.2 U$2.ESP32WROOM3611 | v119.08,16.66 119.89,15.85 120.29,15.85 127.61,8.53 134.52,8.53 v135.33,7.72 | v133.71,6.1 133.71,4.47 136.96,1.22 167.84,1.22 178,11.38 178,17.07 180.03,19.1 SV17.2
  Bottom 0.305: v119.08,16.66 v115.82,19.91 | v133.71,6.1 v135.33,7.72
N$49
  Top 0.305: U$2.ESP32WROOM3626 128.02,30.48 117.86,20.32 117.86,16.26 119.08,15.04 119.89,15.04 127.2,7.72 133.71,7.72 136.14,5.28 SV14.4
N$50
  Top 0.305: U$2.ESP32WROOM3625 128.42,28.04 134.52,34.14 134.52,38.61 135.33,39.42 143.87,39.42 145.09,38.2 145.09,15.85 138.58,9.35 138.58,5.28 SV14.3
N$51
  Top 0.305: U$2.ESP32WROOM3620 128.42,15.44 130.86,15.44 135.74,20.32 SV15.4
N$52
  Top 0.305: U$2.ESP32WROOM3619 128.42,13.01 131.67,13.01 138.18,19.51 138.18,20.32 SV15.3
N$53  (via drill 0.35)
  Top 0.305: v162.56,65.43 v129.64,65.43
  Bottom 0.305: v129.64,65.43 129.64,60.96 125.58,56.9 125.58,45.52 108.92,28.85 108.92,27.64 104.44,23.16 103.23,23.16 U$2.ESP32WROOM3612 | v162.56,65.43 165,62.99 178,62.99 184.1,56.9 184.1,24.79 181.25,21.95 180.44,21.95 SV17.3
N$54  (via drill 0.35)
  Top 0.305: v116.64,22.76 116.64,43.89 127.61,54.86 131.67,54.86 144.68,41.86 146.3,41.86 v147.93,40.23 | v164.19,33.73 171.91,26.01 178,26.01 180.03,23.98 SV17.4
  Bottom 0.305: U$2.ESP32WROOM3617 104.04,10.16 v116.64,22.76 | v147.93,40.23 148.74,41.05 151.18,41.05 151.99,41.86 156.06,41.86 v164.19,33.73
N$55  (via drill 0.35)
  Top 0.305: v35.76,15.04 35.76,19.1 44.7,28.04 44.7,36.17 v43.48,37.39 | v63.8,54.05 71.12,54.05 79.65,45.52 79.65,44.7 SV5.4
  Bottom 0.305: U$1.ESP32WROOM3617 33.73,10.16 34.14,9.75 34.95,9.75 35.76,10.57 v35.76,15.04 | v43.48,37.39 43.48,43.48 54.05,54.05 56.49,54.05 57.3,54.86 58.93,54.86 59.74,54.05 v63.8,54.05
N$56  (via drill 0.35)
  Top 0.305: v43.48,35.76 42.27,35.76 39.01,32.51 39.01,23.57 33.33,17.88 U$1.ESP32WROOM3614 | v47.14,45.52 47.14,58.52 50.39,61.77 v66.65,61.77
  Bottom 0.305: v43.48,35.76 47.14,39.42 v47.14,45.52 | v66.65,61.77 70.31,61.77 70.71,62.18 73.56,62.18 77.22,58.52 77.22,54.86 84.94,47.14 84.94,44.7 SV5.2
N$57
  Top 0.305: SV5.6 74.78,44.7 71.53,44.7 56.9,59.33 52.43,59.33 D2.C
  Bottom 0.305: 150.77,32.92 150.77,34.14 X2.3 | 150.77,32.92 151.99,31.7 154.84,31.7 159.72,26.82 170.69,26.82 172.72,28.85 172.31,29.26 X1.3 | 150.77,32.92 150.37,32.92 149.15,31.7 143.87,31.7 130.86,18.69 130.86,10.57 128.83,8.53 126.8,8.53 126.39,8.13 123.55,8.13 123.14,8.53 104.85,8.53 103.63,7.32 102.01,7.32 96.32,13.01 96.32,27.64 82.91,41.05 76.81,41.05 74.78,43.08 74.78,44.3 SV5.6
N$58
  Top 0.305: R3.2 20.73,40.64 22.35,42.27 26.01,42.27 27.64,40.64 LED3.A
N$59
  Top 0.305: U$1.ESP32WROOM3615 33.33,15.04 34.14,15.04 35.36,13.82 51.21,13.82 58.12,6.91 91.03,6.91 95.1,10.97 95.1,36.58 89.41,42.27 84.53,42.27 82.5,44.3 SV5.3
N$60
  Top 0.305: LED1.K R1.2
N$61
  Top 0.305: R2.2 23.16,45.92 25.2,45.92 LED2.K
N$62
  Top 0.305: U$1.ESP32WROOM366 30.48,40.64 30.48,48.36 28.04,50.8 LED1.A
N$63
  Top 0.305: U$1.ESP32WROOM367 32.92,35.76 29.67,39.01 29.67,43.89 28.04,45.52 LED2.A
N$64
  Top 0.305: R4.2 23.16,35.76 24.79,37.39 26.01,37.39 27.64,35.76 LED4.A
N$65  (via drill 0.35)
  Top 0.305: v52.83,35.36 52.83,42.27 50.8,44.3 46.74,44.3 36.17,54.86 32.51,54.86 31.29,53.65 31.29,45.11 v31.7,44.7
  Bottom 0.305: U$1.ESP32WROOM3626 57.3,30.48 52.83,34.95 v52.83,35.36 | v31.7,44.7 31.29,45.11 29.26,43.08 24.38,43.08 22.76,41.45 22.76,40.64 R3.1
N$66  (via drill 0.35)
  Top 0.305: v55.68,28.04 55.68,23.98 46.74,15.04 v40.23,15.04 | v36.98,11.79 33.73,8.53 32.51,8.53 26.01,15.04 v26.01,21.54
  Bottom 0.305: v55.68,28.04 58.12,28.04 U$1.ESP32WROOM3625 | v36.98,11.79 v40.23,15.04 | v26.01,21.54 13.01,34.54 13.01,35.36 R4.1
N$67  (via drill 0.35)
  Top 0.305: v119.08,13.01 119.08,5.69 121.92,2.85 LED6.A
  Bottom 0.305: v119.08,13.01 119.08,15.04 120.29,16.26 120.29,25.6 119.08,26.82 119.08,32.11 121.92,34.95 R5.2
N$68
  Top 0.305: U$2.ESP32WROOM3622 128.42,20.32 135.74,27.64 135.74,36.58 SV18.4
N$69
  Top 0.305: U$2.ESP32WROOM3621 128.42,17.88 138.18,27.64 138.18,36.58 SV18.3
N$70  (via drill 0.35)
  Top 0.305: v121.92,10.16 121.92,8.94 128.02,2.85 LED5.A
  Bottom 0.305: R6.2 121.92,27.23 121.51,26.82 121.51,26.01 121.92,25.6 v121.92,10.16
(copper drawn outside any net)
  shapes: Top area x2

### Text on the board
tNames: 12V | 5V | IMU1 | MOTOR L | IMU2 | MOTOR R | Autonomous Systems and Intelligent Sensing Laboratory | KELLA
_tNames: SDX | SDX | I2C | UART2 | UART0 | TOUCH | TOUCH | REALY | ADC | HSPI | SENSOR | VSPI | DAC | TOUCH